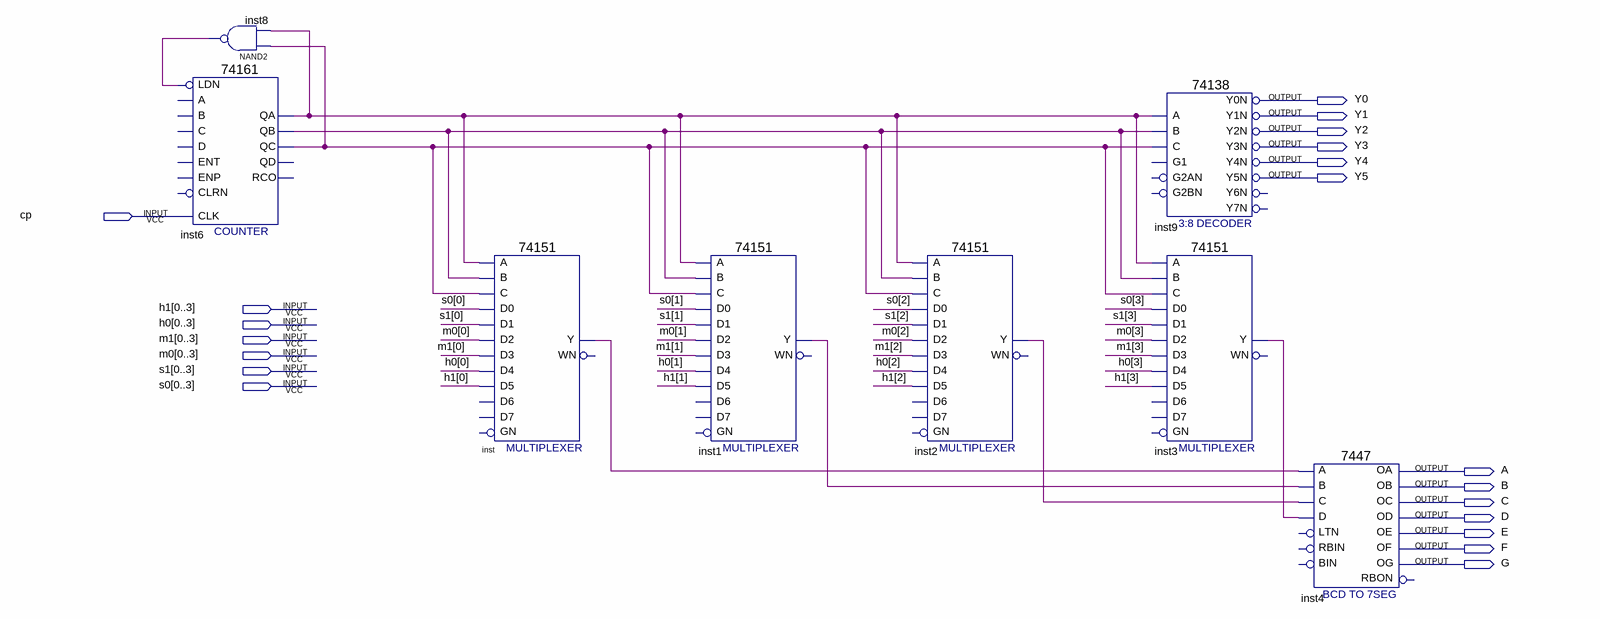
[diagram p0: schematic sheet]
// Quartus schematic sm.bdf as structural Verilog: 8 symbols, 20 pins
module sm (
  input  cp,
  input  [0:3] h1,
  input  [0:3] h0,
  input  [0:3] m1,
  input  [0:3] m0,
  input  [0:3] s1,
  input  [0:3] s0,
  output Y0,
  output Y1,
  output Y2,
  output Y3,
  output Y4,
  output Y5,
  output A,
  output B,
  output C,
  output D,
  output E,
  output F,
  output G
);

  wire inst1_y, inst2_y, inst3_y, inst6_qa, inst6_qb, inst6_qc, inst8_out, inst_y;

  \74161  inst6 (
    .CLK(cp), .LDN(inst8_out), .QC(inst6_qc), .QB(inst6_qb), .QA(inst6_qa));  // open: CLRN, ENP, A, D, ENT, B, C, QD, RCO
  nand inst8 (inst8_out, inst6_qc, inst6_qa);
  \74151  inst (
    .C(inst6_qc), .B(inst6_qb), .A(inst6_qa), .D5(h1[0]), .D0(s0[0]), .D1(s1[0]), .D4(h0[0]), .D3(m1[0]),
    .D2(m0[0]), .Y(inst_y));  // open: GN, D6, D7, WN
  \74151  inst1 (
    .C(inst6_qc), .B(inst6_qb), .A(inst6_qa), .D5(h1[1]), .D0(s0[1]), .D1(s1[1]), .D4(h0[1]), .D3(m1[1]),
    .D2(m0[1]), .Y(inst1_y));  // open: GN, D6, D7, WN
  \74151  inst2 (
    .C(inst6_qc), .B(inst6_qb), .A(inst6_qa), .D5(h1[2]), .D0(s0[2]), .D1(s1[2]), .D4(h0[2]), .D3(m1[2]),
    .D2(m0[2]), .Y(inst2_y));  // open: GN, D6, D7, WN
  \74138  inst9 (
    .A(inst6_qa), .B(inst6_qb), .C(inst6_qc), .Y0N(Y0), .Y1N(Y1), .Y2N(Y2), .Y3N(Y3), .Y4N(Y4), .Y5N(Y5));  // open: G1, G2AN, G2BN, Y6N, Y7N
  \74151  inst3 (
    .C(inst6_qc), .B(inst6_qb), .A(inst6_qa), .D5(h1[3]), .D0(s0[3]), .D1(s1[3]), .D4(h0[3]), .D3(m1[3]),
    .D2(m0[3]), .Y(inst3_y));  // open: GN, D6, D7, WN
  \7447  inst4 (
    .B(inst1_y), .C(inst2_y), .D(inst3_y), .A(inst_y), .OB(B), .OC(C), .OE(E), .OD(D), .OF(F), .OG(G), .OA(A));  // open: LTN, RBIN, BIN, RBON
endmodule
